# Altium schematic sheet primary_cap_int.SchDoc
size A3
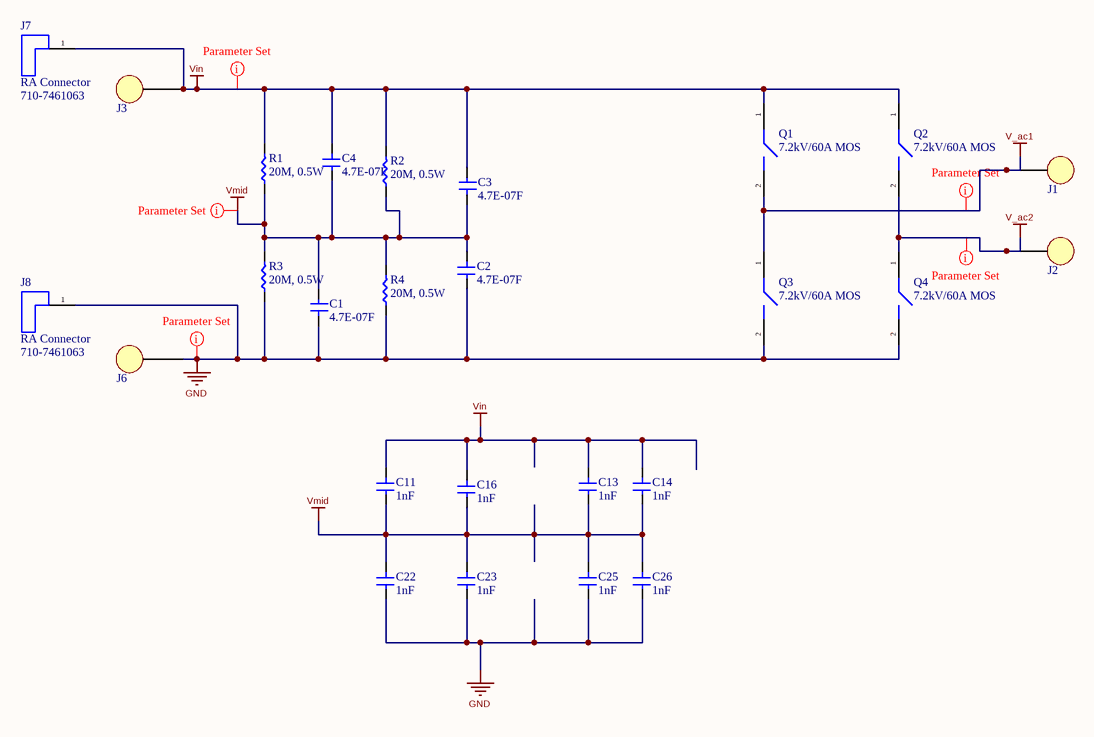
[diagram p0: primary_cap_int.SchDoc]

## Parts
C1  4.7E-07F  [C4BSYBX3470ZBMJ]
C2  4.7E-07F  [C4BSYBX3470ZBMJ]
C3  4.7E-07F  [C4BSYBX3470ZBMJ]
C4  4.7E-07F  [C4BSYBX3470ZBMJ]
C11  1nF  [PHE450XB4100JB04R17]
C13  1nF  [PHE450XB4100JB04R17]
C14  1nF  [PHE450XB4100JB04R17]
C16  1nF  [PHE450XB4100JB04R17]
C22  1nF  [PHE450XB4100JB04R17]
C23  1nF  [PHE450XB4100JB04R17]
C25  1nF  [PHE450XB4100JB04R17]
C26  1nF  [PHE450XB4100JB04R17]
J1  TERM PCB SNAP-IN VERT HD M5 THRD  [M4_9pin_shank]  (value not drawn)
J2  TERM PCB SNAP-IN VERT HD M5 THRD  [M4_9pin_shank]  (value not drawn)
J3  TERM PCB SNAP-IN VERT HD M5 THRD  [M4_9pin_shank]  (value not drawn)
J6  TERM PCB SNAP-IN VERT HD M5 THRD  [M4_9pin_shank]  (value not drawn)
J7  RA Connector  Supplier Part Number 1: 710-7461063  [7461063]
J8  RA Connector  Supplier Part Number 1: 710-7461063  [7461063]
Q1  7.2kV/60A MOS  [Austin Supermos_r1]
Q2  7.2kV/60A MOS  [Austin Supermos_r1]
Q3  7.2kV/60A MOS  [Austin Supermos_r1]
Q4  7.2kV/60A MOS  [Austin Supermos_r1]
R1  20M, 0.5W  [VR37000002005JR500]
R2  20M, 0.5W  [VR37000002005JR500]
R3  20M, 0.5W  [VR37000002005JR500]
R4  20M, 0.5W  [VR37000002005JR500]

## Nets
GND: C1.2 C2.1 C22.1 C23.1 C25.1 C26.1 J6.1 J8.1 Q3.2 Q4.2 R3.1 R4.1
V_ac1: J1.1 Q1.2 Q3.1
V_ac2: J2.1 Q2.2 Q4.1
Vin: C3.1 C4.2 C11.2 C13.2 C14.2 C16.2 J3.1 J7.1 Q1.1 Q2.1 R1.2 R2.2
Vmid: C1.1 C2.2 C3.2 C4.1 C11.1 C13.1 C14.1 C16.1 C22.2 C23.2 C25.2 C26.2 R1.1 R2.1 R3.2 R4.2

## Layout directives
net class PowerNets: GND, V_ac1, V_ac2, Vin, Vmid

## Library data of the parts
C1-C4 = C4BSYBX3470ZBMJ: Cap, 0.47UF, 750VAC, Film, Radial; Manufacturer: KEMET; Supplier 1: Digi-Key; Manufacturer Part Number: C4BSYBX3470ZBMJ; Stock 1: 0; Pricing 1: 1=11.2, 10=10.64, 100=8.4, 500=7.448, 1000=7 (USD); Capacitance: 4.7E-07F; Supplier Part Number 1: 399-15655-ND
C11 C13 C14 C16 C22 C23 C25 C26 = PHE450XB4100JB04R17: CAP FILM 1000PF 5% 3KVDC RADIAL; Manufacturer: KEMET; Dielectric Material: PP; Voltage Rating (DC): 3kV; Voltage Rating (AC): 1kV; Supplier 1: Digi-Key; Manufacturer Part Number: PHE450XB4100JB04R17; Stock 1: 2106; Pricing 1: 1=0.66, 10=0.485, 100=0.3329, 500=0.26354, 1000=0.22192, 2500=0.20805, 5000=0.19418 (USD); Mount: Through Hole; Case/Package: Radial; Min Operating Temperature: -55°C; Max Operating Temperature: 105°C; Capacitance: 1nF; Packaging: Bulk; Dielectric: PP; Termination: PC Pins; Voltage Rating: 3kV; Tolerance: 5%; Length: 0.709inch; Width: 0.217inch; Height - Seated (Max): 0.413inch; Lead Pitch: 0.591inch; REACH SVHC: No SVHC; Supplier Part Number 1: 399-12392-ND
J1-J3 J6 = 7807: Manufacturer: Keystone Electronics; Current Rating: 30A; Insulation: Non-Insulated; Supplier 1: Digi-Key; Manufacturer Part Number: 7807; Stock 1: 3822; Pricing 1: 1=0.71, 10=0.668, 50=0.5342, 100=0.512, 250=0.46748, 500=0.4452, 1000=0.3989, 2500=0.3339, 5000=0.32277 (USD); Mount: Through Hole; Number of Pins: 6; Contact Material: Brass; Contact Plating: Tin; Material: Brass; Package Quantity: 100; Termination: Power; Thread Size: M5; Lead Free: Lead Free; ComponentLink1URL: http://www.mouser.com/ds/2/215/807-741218.pdf?src-supplier=Mouser; ComponentLink1Description: http://www.mouser.com/ds/2/215/807-741218.pdf?src-supplier=Mouser; Supplier Part Number 1: 36-7807-ND
J7 J8 = 7461063: TERM PWR ELEMENT M4 8 PIN PCB RA; Manufacturer: Wurth Electronics; Current Rating: 80A; Number of Contacts: 8; Insulation: Non-Insulated; Supplier 1: Mouser; Manufacturer Part Number: 7461063; Stock 1: 85; Pricing 1: 1=6.36, 10=5.89, 50=5.35, 100=4.86, 1000=3.63, 10000=3.63 (USD); Mount: Through Hole; Number of Pins: 8; Contact Plating: Tin; Contact Material: Copper; Min Operating Temperature: -40°C; Max Operating Temperature: 135°C; Package Quantity: 250; Packaging: Bulk; Number of Rows: 2; Termination: Press-Fit; Length: 9mm; Height: 17.5mm; Width: 9mm; Thread Size: M4; REACH SVHC: Unknown; ComponentLink1URL: https://katalog.we-online.de/em/datasheet/7461063.pdf?src-supplier=Digi-Key; ComponentLink1Description: https://katalog.we-online.de/em/datasheet/7461063.pdf?src-supplier=Digi-Key; ComponentLink2URL: http://www.farnell.com/datasheets/1736679.pdf?src-supplier=Element14; ComponentLink2Description: http://www.farnell.com/datasheets/1736679.pdf?src-supplier=Element14
Q1-Q4 = Austin SuperMos
R1-R4 = VR37000002005JR500: RES 20M OHM 1/2W 5% AXIAL; Manufacturer: Vishay BCcomponents; Resistance: 20MR; Power Rating: 500mW; Voltage Rating: 3.5kV; Temperature Coefficient: 200ppm/°C; Lead Diameter: 0.7mm; Supplier 1: Digi-Key; Manufacturer Part Number: VR37000002005JR500; Stock 1: 9314; Pricing 1: 1=0.5, 10=0.38, 25=0.2888, 50=0.2146, 100=0.1595, 250=0.13476, 500=0.1155, 1000=0.088 (USD); Case/Package: Axial; Number of Pins: 2; Contact Plating: Tin; Min Operating Temperature: -55°C; Max Operating Temperature: 155°C; Tolerance: 5%; Package Quantity: 1; Packaging: Tape and Reel; Composition: Metal Film,Metal Foil; Number of Terminations: 2; Termination: Axial; Max Power Dissipation: 500mW; Voltage Rating (DC): 3.5kV; Diameter: 4mm; Length: 0.354inch; Height: 10mm; Radiation Hardening: No; REACH SVHC: Unknown; ComponentLink1URL: http://www.vishay.com/docs/28907/vr25vr37vr68.pdf?src-supplier=Digi-Key; ComponentLink1Description: http://www.vishay.com/docs/28907/vr25vr37vr68.pdf?src-supplier=Digi-Key; ComponentLink2URL: https://www.alliedelec.com/m/d/49f973c898c77c7c8d8417452e4d0503.pdf?src-supplier=Allied+Electronics; ComponentLink2Description: https://www.alliedelec.com/m/d/49f973c898c77c7c8d8417452e4d0503.pdf?src-supplier=Allied+Electronics; ComponentLink3URL: http://www.farnell.com/datasheets/2049639.pdf?src-supplier=Element14; ComponentLink3Description: http://www.farnell.com/datasheets/2049639.pdf?src-supplier=Element14; ComponentLink4URL: http://www.vishay.com/docs/28733/28733.pdf?src-supplier=Avnet; ComponentLink4Description: http://www.vishay.com/docs/28733/28733.pdf?src-supplier=Avnet; Supplier Part Number 1: PPCHHJ20MCT-ND